# Altium schematic sheet ST_LINK_V2-1.SCHDOC: ST-LINK/V2-1
size A4; DocumentNumber: MB1165; Revision: C.1; SheetNumber: 15; SheetTotal: 17; Project: STM32469I-EVAL
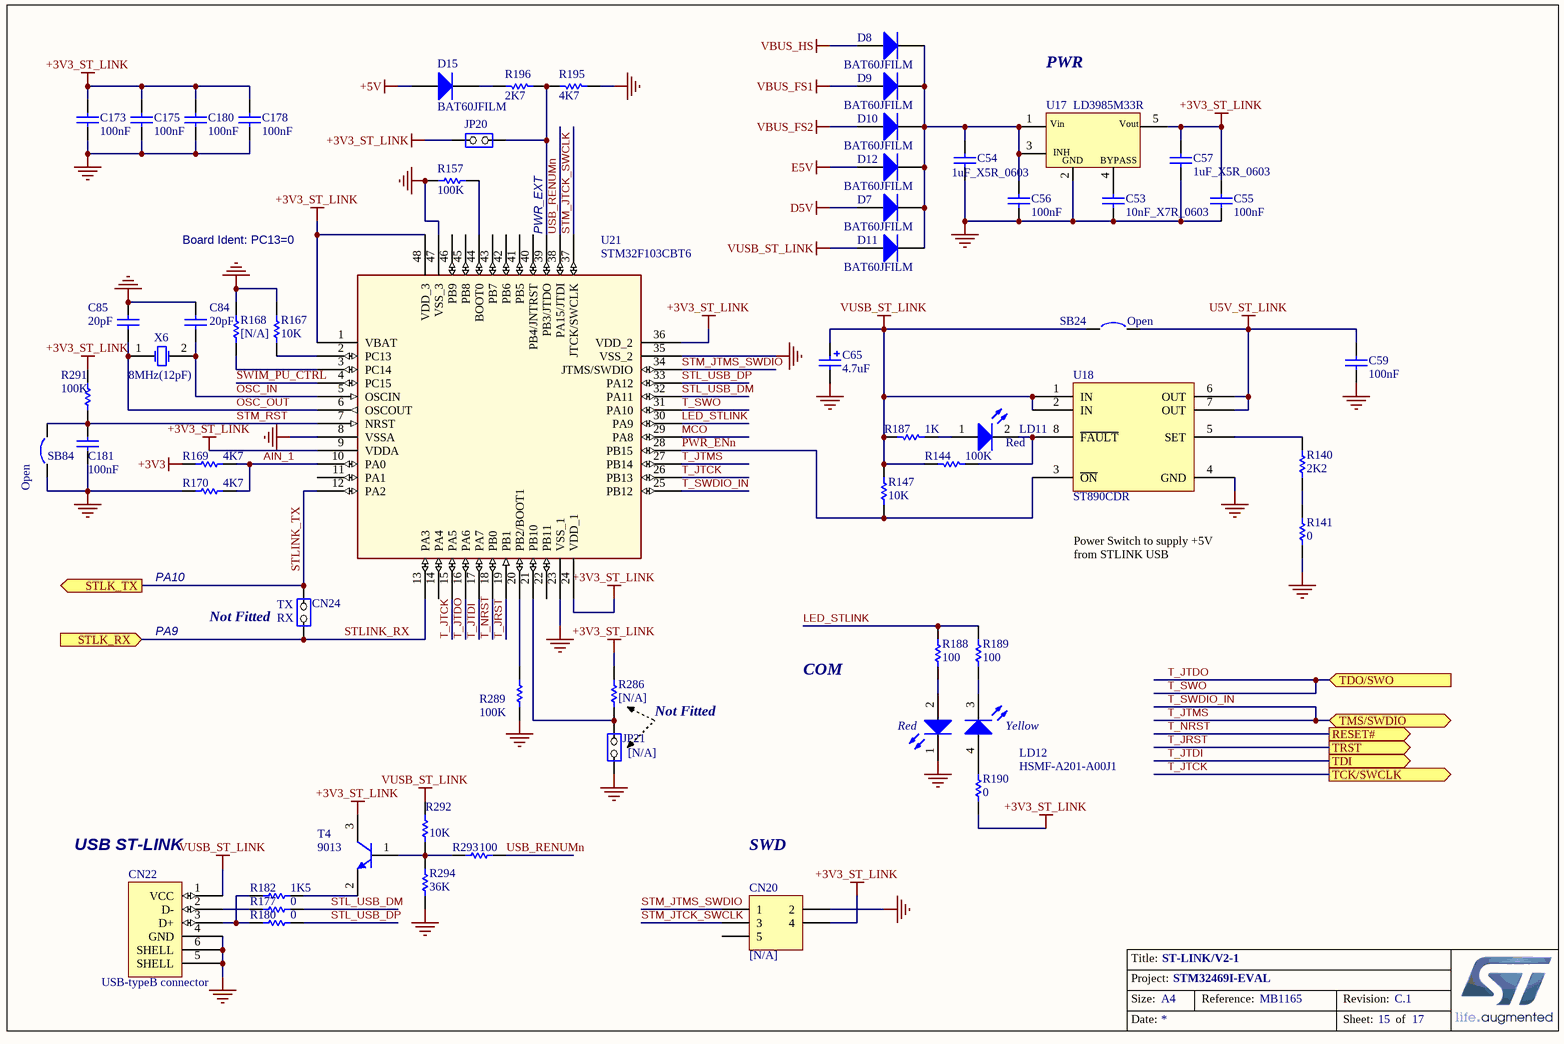
[diagram p0: ST_LINK_V2-1.SCHDOC]

## Parts
C53  10nF_X7R_0603  [0603C]
C54  1uF_X5R_0603  [0603C]
C55  100nF  [0603C]
C56  100nF  [0603C]
C57  1uF_X5R_0603  [0603C]
C59  100nF  [0603C]
C65  4.7uF  [TAN-A]
C84  20pF  [0603C]
C85  20pF  [0603C]
C173  100nF  [0603C]
C175  100nF  [0603C]
C178  100nF  [0603C]
C180  100nF  [0603C]
C181  100nF  [0603C]
CN20  [N/A]  [HDR_2X3-1_2R54-6]
CN22  USB-typeB connector  [USB-B]
CN24  (no value)  [SIP2]
D7  BAT60JFILM  [SOD-323]
D8  BAT60JFILM  [SOD-323]
D9  BAT60JFILM  [SOD-323]
D10  BAT60JFILM  [SOD-323]
D11  BAT60JFILM  [SOD-323]
D12  BAT60JFILM  [SOD-323]
D15  BAT60JFILM  [SOD-323]
JP20  (no value)  [SIP2]
JP21  [N/A]  [SIP2]
LD11  Red  [0603D]
LD12  HSMF-A201-A00J1  [LED2_3528]
R140  2K2  [0402R]
R141  0  [0603R]
R144  100K  [0603R]
R147  10K  [0402R]
R157  100K  [0603R]
R167  10K  [0603R]
R168  [N/A]  [0603R]
R169  4K7  [0603R]
R170  4K7  [0603R]
R177  0  [0603R]
R180  0  [0603R]
R182  1K5  [0603R]
R187  1K  [0603R]
R188  100  [0603R]
R189  100  [0603R]
R190  0  [0603R]
R195  4K7  [0603R]
R196  2K7  [0603R]
R286  [N/A]  [0603R]
R289  100K  [0603R]
R291  100K  [0603R]
R292  10K  [0603R]
R293  100  [0603R]
R294  36K  [0603R]
SB24  Open  [SB_0603]
SB84  Open  [SB_0603]
T4  9013  [SOT-23]
U17  LD3985M33R  [SOT23-5]
U18  ST890CDR  [SOIC8_1R27_4R9X6]
U21  STM32F103CBT6  [LQFP48_0R5_9X9]
X6  8MHz(12pF)  [XTAL_2SM_12R7X4R7]

## Ports
RESET# (out), STLK_RX (in), STLK_TX (out), TCK/SWCLK (out), TDI (out), TDO/SWO (in), TMS/SWDIO (bidir), TRST (out)

## Nets
+3V3: R169.1
+3V3_ST_LINK: C55.2 C57.1 C173.2 C175.2 C178.2 C180.2 CN20.4 JP20.1(COMMON) R190.2 R286.1 R291.2 T4.3(C) U17.5(Vout) U21.1(VBAT) U21.9(VDDA) U21.24(VDD_1) U21.36(VDD_2) U21.48(VDD_3)
+5V: D15.1(A)
D5V: D7.1(A)
E5V: D12.1(A)
GND: C53.1 C54.1 C55.1 C56.1 C57.2 C59.1 C65.2 C84.2 C85.2 C173.1 C175.1 C178.1 C180.1 C181.1 CN20.2 CN22.4(GND) CN22.5(SHELL) CN22.6(SHELL) JP21.1(COMMON) LD12.1(RED_cathode) R141.1 R157.1 R167.1 R168.1 R170.1 R195.2 R289.1 R294.1 SB84.1 U17.2(GND) U18.4(GND) U21.8(VSSA) U21.23(VSS_1) U21.35(VSS_2) U21.47(VSS_3)
U5V_ST_LINK: C59.2 SB24.2 U18.6(OUT) U18.7(OUT)
VBUS_FS1: D9.1(A)
VBUS_FS2: D10.1(A)
VBUS_HS: D8.1(A)
VUSB_ST_LINK: C65.1 CN22.1(VCC) D11.1(A) R144.1 R147.1 R187.1 R292.2 SB24.1 U18.1(IN) U18.2(IN)
AIN_1: R169.2 R170.2 U21.10(PA0)
LED_STLINK: R188.1 R189.1 U21.30(PA9)
MCO: U21.29(PA8)
OSC_IN: C84.1 U21.5(OSCIN) X6.2(OSC2)
OSC_OUT: C85.1 U21.6(OSCOUT) X6.1(OSC1)
PWR_ENn: R147.2 U18.3(~{ON}) U21.28(PB15)
STL_USB_DM: R177.2 U21.32(PA11)
STL_USB_DP: R180.2 U21.33(PA12)
STLINK_RX: CN24.1(COMMON) U21.13(PA3) ; port STLK_RX
STLINK_TX: CN24.2(NO) U21.12(PA2) ; port STLK_TX
STM_JTCK_SWCLK: CN20.3 U21.37(JTCK/SWCLK)
STM_JTMS_SWDIO: CN20.1 U21.34(JTMS/SWDIO)
STM_RST: C181.2 R291.1 SB84.2 U21.7(NRST)
SWIM_PU_CTRL: U21.4(PC15)
T_JRST: U21.19(PB1) ; port TRST
T_JTCK: U21.15(PA5) U21.26(PB13) ; port TCK/SWCLK
T_JTDI: U21.17(PA7) ; port TDI
T_JTDO: U21.16(PA6) U21.31(PA10) ; port TDO/SWO  [also labelled T_SWO]
T_JTMS: U21.25(PB12) U21.27(PB14) ; port TMS/SWDIO  [also labelled T_SWDIO_IN]
T_NRST: U21.18(PB0) ; port RESET#
USB_RENUMn: R293.2 U21.38(PA15/JTDI)
NetC53_2: C53.2 U17.4(BYPASS)
NetC54_2: C54.2 C56.2 D7.2(K) D8.2(K) D9.2(K) D10.2(K) D11.2(K) D12.2(K) U17.1(Vin) U17.3(CE)
NetCN22_2: CN22.2(D-) R177.1
NetCN22_3: CN22.3(D+) R180.1 R182.1
NetD15_2: D15.2(K) R196.1
NetJP20_2: JP20.2(NO) R195.1 R196.2 U21.39(PB3/JTDO)
NetJP21_2: JP21.2(NO) R286.2 U21.21(PB10)
NetLD11_1: LD11.1(A) R187.2
NetLD11_2: LD11.2(K) R144.2 U18.8(~{FAULT})
NetLD12_2: LD12.2(Red_anode) R188.2
NetLD12_3: LD12.3(YellowGreen_cathode) R189.2
NetLD12_4: LD12.4(YellowGreen_anode) R190.1
NetR140_1: R140.1 R141.2
NetR140_2: R140.2 U18.5(SET)
NetR157_2: R157.2 U21.44(BOOT0)
NetR167_2: R167.2 U21.2(PC13)
NetR168_2: R168.2 U21.3(PC14)
NetR182_2: R182.2 T4.2(E)
NetR289_2: R289.2 U21.20(PB2/BOOT1)
NetR292_1: R292.1 R293.1 R294.2 T4.1(B)

Not connected (* = marked no-connect by the designer): CN20 5; U21 11(PA1) 14(PA4) 22(PB11) 40(PB4/JNTRST) 41(PB5) 42(PB6) 43(PB7) 45(PB8) 46(PB9)

## Notes on the sheet
- PWR
- Board Ident: PC13=0
- (near U21) PWR_EXT
- PA10
- Power Switch to supply +5V from STLINK USB
- PA9
- (near CN24) Not Fitted
- (near CN24) TX
- (near CN24) RX
- Not Fitted
- COM
- (near CN22) USB ST-LINK
- SWD
- Title:
- Project:
- Size:
- Date:
- A4
- Reference:
- Sheet:
- Revision:
- of
- (in symbol HSMF-A201-A00J1) Red; Yellow
- (in symbol LD3985M33R) INH

## Library data of the parts
C53 = CAP SMD 0603  X7R 10000PF 50V 10%: 0603  X7R 10NF; Order code RS: 2040779; Rated voltage: 50V; Tolerance: 10%; Order code Farnell: 7569548RL; Value: 10NF; Power: *; Technology: X7R; Temperature Factor: *; Temperature Min: -55°C; Temperature Max: +125°C; STS Code: *
C54 C57 = CAP SMD 0603  X5R 1µF 25V 10%: 0603  X5R 1µF; Rated voltage: 25V; Tolerance: 10%; Manufacturer: *; Manufacturer P/N: *; Order code Farnell: 1288202RL; Value: 1µF; Power: *; Technology: X5R; Temperature  Factor: *; Temperature Max: +125°C; Temperature Min: -55°C; STS Code: *
C55 C56 C59 C173 C175 C178 C180 C181 = Capacitor_ST: Capacitor 0402 / 0603 / 0805; Revision: July-2002: Re-released for DXP Platform.; Value: 100nF
C65 = Cap Pol1: Polarized Capacitor (Radial); Value: 100pF; Ordered by: Subcon; Published: 8-Jun-2000; Revision: July-2002: Re-released for DXP Platform.; Publisher: Altium Limited
C84 C85 = Capacitor_ST: Capacitor 0402 / 0603 / 0805; Value: 100nF; Revision: July-2002: Re-released for DXP Platform.
CN20 = Header 3X2: Header, 3-Pin, Dual row; Revision: 17-Jul-2002: Re-released for DXP Platform.; Publisher: Altium Limited
CN24 = JP2: Fitted: NO
D7-D12 = BAT60JFILM: Manuf_1: STM; Provided: ST; ECCN_US/EU: EAR99/NEC; Revision: July-2002: Re-released for DXP Platform.; Order: BAT60JFILM; Manuf_Part_1: BAT60JFILM; Distrib: ST
D15 = Diode: Default Diode; Code - JEDEC: DO-214-AB; Ordered by: STM; ECCN_US/EU: EAR99/NEC; Published: 8-Jun-2000; Revision: July-2002: Re-released for DXP Platform.; Publisher: Altium Limited
JP20 = JP2: Ordered by: Subcon; Silkscreen: Pwr_ext
JP21 = JP2
LD11 = LED2: Typical RED, GREEN, YELLOW, AMBER GaAs LED; Published: 8-Jun-2000; Revision: July-2002: Re-released for DXP Platform.; Publisher: Altium Limited
R140 R157 R177 R180 R182 R289 R291 R293 = Resistor_ST: Resistor 0402 / 0603 / 0805; Description: Resistor 0402 or 0603 or 0805; Value: 10K
R141 R188-R190 R195 R196 R286 R292 R294 = Res1: Resistor; Value: 1K; Published: 8-Jun-2000; Revision: July-2002: Re-released for DXP Platform.; Publisher: Altium Limited
R144 = Res1: Resistor; Value: 1K; Ordered by: Subcon; Published: 8-Jun-2000; Revision: July-2002: Re-released for DXP Platform.; Publisher: Altium Limited
R147 R167 = Resistor_ST: Resistor 0402 / 0603 / 0805; Description: Resistor 0402 or 0603 or 0805; Value: 10K
R168-R170 = Resistor_ST: Resistor 0402 / 0603 / 0805; Description: Resistor 0402 or 0603 or 0805; Value: 10K; Fitted: NO
R187 = Res1: Resistor; Ordered by: Subcon; Published: 8-Jun-2000; Revision: July-2002: Re-released for DXP Platform.; Publisher: Altium Limited; Value: 1K
SB24 SB84 = Circuit Breaker: Published: 24-Mar-1999; Revision: July-2002: Re-released for DXP Platform.; Publisher: Altium Limited
T4 = NPN: NPN Bipolar Transistor; Code - JEDEC: TO-226-AA; Published: 8-Jun-2000; Revision: July-2002: Re-released for DXP Platform.; Publisher: Altium Limited
U17 = LD3985M33R: Ultra low drop-low noise BiCMOS voltage, regulators low ESR capacitors compatible; Manuf_1: STM; Provided: ST; Ref St: 9176161; ECCN_US/EU: EAR99/NEC; Manuf_Part_1: LD3985M33R; Distrib: ST; Order: LD3985M33R
U21 = STM32F103CBT6: Medium-density performance line ARM-based 32-bit MCU with 64KB Flash; Manuf_Part_1: STM32F103C8T6; Manuf_1: STM; Ref St: 9175981; Provided: ST; ECCN_US/EU: 3A991A2/NEC; Footprint: QFP48 7X7; Distrib: ST; Order: STM32F103C8T6
X6 = XTAL: Crystal Oscillator; Published: 8-Jun-2000; LatestRevisionDate: 17-Jul-2002; LatestRevisionNote: Re-released for DXP Platform.; PackageReference: R38; Publisher: Altium Limited